# EAGLE design Pure_Seq_SMD_V2_2 (EAGLE 7.5.0)
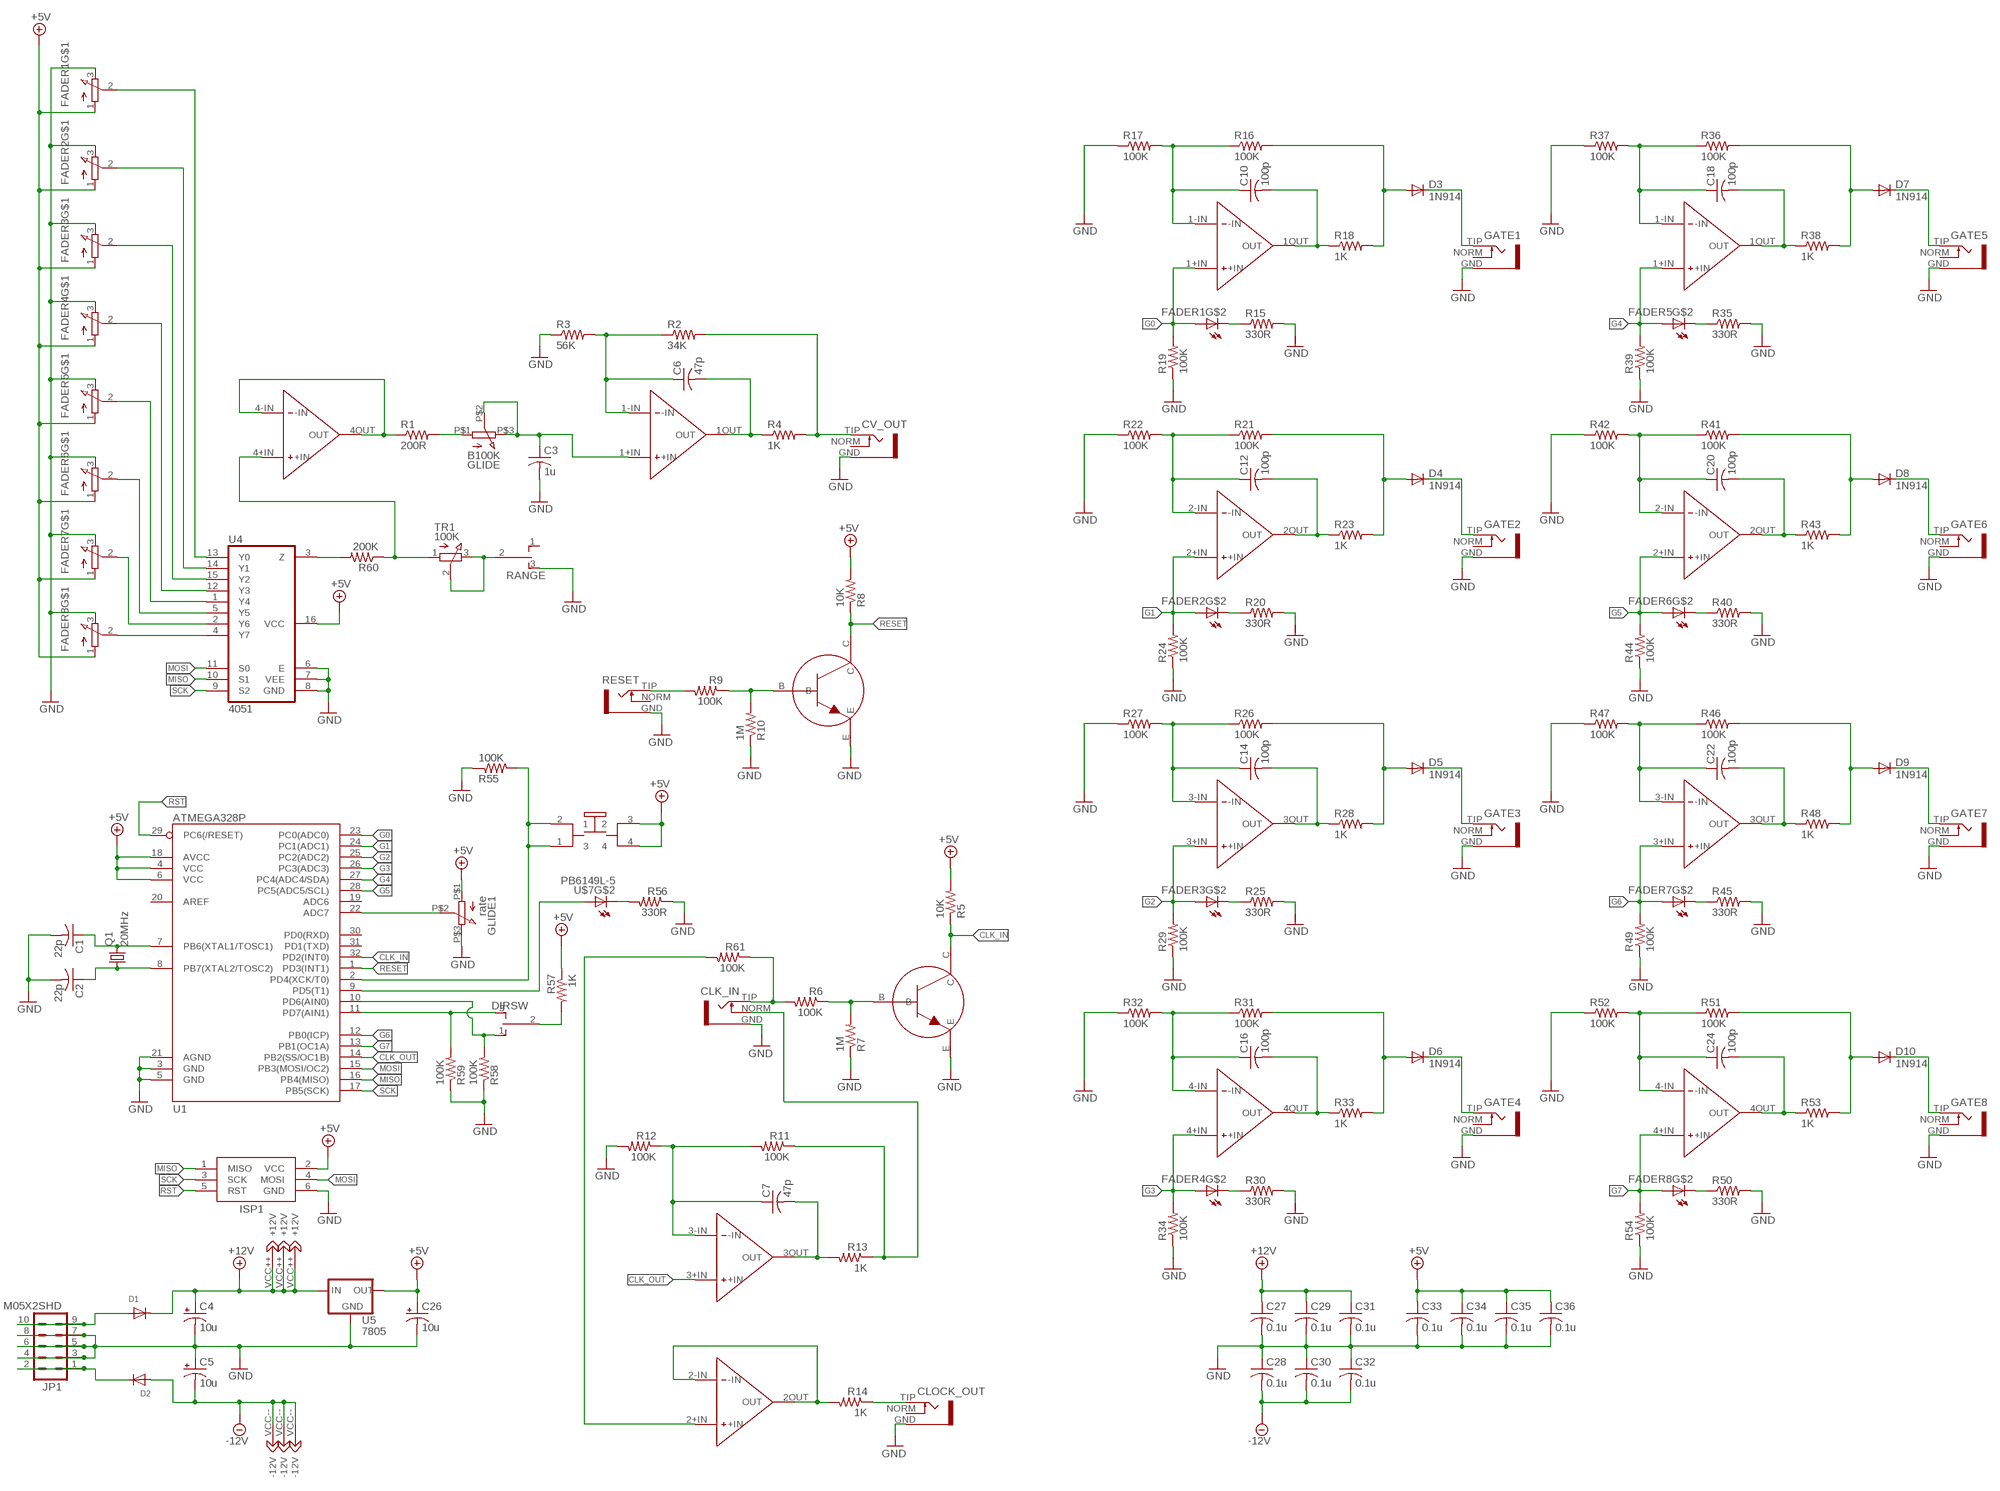
[diagram p0: schematic, sheet 1]

## Parts
C1  22p  C-USC0805K  [C0805K]
C2  22p  C-USC0805K  [C0805K]
C3  1u  C-USC0805K  [C0805K]
C4  10u  CPOL-US153CLV-0505  [153CLV-0505]
C5  10u  CPOL-US153CLV-0505  [153CLV-0505]
C6  47p  C-USC0805K  [C0805K]
C7  47p  C-USC0805K  [C0805K]
C10  100p  C-USC0805K  [C0805K]
C12  100p  C-USC0805K  [C0805K]
C14  100p  C-USC0805K  [C0805K]
C16  100p  C-USC0805K  [C0805K]
C18  100p  C-USC0805K  [C0805K]
C20  100p  C-USC0805K  [C0805K]
C22  100p  C-USC0805K  [C0805K]
C24  100p  C-USC0805K  [C0805K]
C26  10u  CPOL-US153CLV-0505  [153CLV-0505]
C27  0.1u  C-USC0805K  [C0805K]
C28  0.1u  C-USC0805K  [C0805K]
C29  0.1u  C-USC0805K  [C0805K]
C30  0.1u  C-USC0805K  [C0805K]
C31  0.1u  C-USC0805K  [C0805K]
C32  0.1u  C-USC0805K  [C0805K]
C33  0.1u  C-USC0805K  [C0805K]
C34  0.1u  C-USC0805K  [C0805K]
C35  0.1u  C-USC0805K  [C0805K]
C36  0.1u  C-USC0805K  [C0805K]
CLK_IN  S_JACK  [S_JACK]
CLOCK_OUT  S_JACK  [S_JACK]
CV_OUT  S_JACK  [S_JACK]
D1  DIODESMA  [SMADIODE]
D2  DIODESMA  [SMADIODE]
D3  1N914  DIODESOD  [SOD-323]
D4  1N914  DIODESOD  [SOD-323]
D5  1N914  DIODESOD  [SOD-323]
D6  1N914  DIODESOD  [SOD-323]
D7  1N914  DIODESOD  [SOD-323]
D8  1N914  DIODESOD  [SOD-323]
D9  1N914  DIODESOD  [SOD-323]
D10  1N914  DIODESOD  [SOD-323]
DIRSW  TOGGLE_ON_OFF_ON  [TOGGLE_ON_OFF_ON]
FADER1  LED_FADER  [LED_FADER]
FADER2  LED_FADER  [LED_FADER]
FADER3  LED_FADER  [LED_FADER]
FADER4  LED_FADER  [LED_FADER]
FADER5  LED_FADER  [LED_FADER]
FADER6  LED_FADER  [LED_FADER]
FADER7  LED_FADER  [LED_FADER]
FADER8  LED_FADER  [LED_FADER]
GATE1  S_JACK  [S_JACK]
GATE2  S_JACK  [S_JACK]
GATE3  S_JACK  [S_JACK]
GATE4  S_JACK  [S_JACK]
GATE5  S_JACK  [S_JACK]
GATE6  S_JACK  [S_JACK]
GATE7  S_JACK  [S_JACK]
GATE8  S_JACK  [S_JACK]
GLIDE  B100K  Q-POT  [Q-POT]
GLIDE1  rate  Q-POT  [Q-POT]
ISP1  AVRISP-6  [AVRISP]
JP1  M05X2SHD  [2X5-SHROUDED]
Q1  20MHz  CRYSTALHC49UP  [HC49UP]
R1  200R  R-US_R0805  [R0805]
R2  34K  R-US_R0805  [R0805]
R3  56K  R-US_R0805  [R0805]
R4  1K  R-US_R0805  [R0805]
R5  10K  R-US_R0805  [R0805]
R6  100K  R-US_R0805  [R0805]
R7  1M  R-US_R0805  [R0805]
R8  10K  R-US_R0805  [R0805]
R9  100K  R-US_R0805  [R0805]
R10  1M  R-US_R0805  [R0805]
R11  100K  R-US_R0805  [R0805]
R12  100K  R-US_R0805  [R0805]
R13  1K  R-US_R0805  [R0805]
R14  1K  R-US_R0805  [R0805]
R15  330R  R-US_R0805  [R0805]
R16  100K  R-US_R0805  [R0805]
R17  100K  R-US_R0805  [R0805]
R18  1K  R-US_R0805  [R0805]
R19  100K  R-US_R0805  [R0805]
R20  330R  R-US_R0805  [R0805]
R21  100K  R-US_R0805  [R0805]
R22  100K  R-US_R0805  [R0805]
R23  1K  R-US_R0805  [R0805]
R24  100K  R-US_R0805  [R0805]
R25  330R  R-US_R0805  [R0805]
R26  100K  R-US_R0805  [R0805]
R27  100K  R-US_R0805  [R0805]
R28  1K  R-US_R0805  [R0805]
R29  100K  R-US_R0805  [R0805]
R30  330R  R-US_R0805  [R0805]
R31  100K  R-US_R0805  [R0805]
R32  100K  R-US_R0805  [R0805]
R33  1K  R-US_R0805  [R0805]
R34  100K  R-US_R0805  [R0805]
R35  330R  R-US_R0805  [R0805]
R36  100K  R-US_R0805  [R0805]
R37  100K  R-US_R0805  [R0805]
R38  1K  R-US_R0805  [R0805]
R39  100K  R-US_R0805  [R0805]
R40  330R  R-US_R0805  [R0805]
R41  100K  R-US_R0805  [R0805]
R42  100K  R-US_R0805  [R0805]
R43  1K  R-US_R0805  [R0805]
R44  100K  R-US_R0805  [R0805]
R45  330R  R-US_R0805  [R0805]
R46  100K  R-US_R0805  [R0805]
R47  100K  R-US_R0805  [R0805]
R48  1K  R-US_R0805  [R0805]
R49  100K  R-US_R0805  [R0805]
R50  330R  R-US_R0805  [R0805]
R51  100K  R-US_R0805  [R0805]
R52  100K  R-US_R0805  [R0805]
R53  1K  R-US_R0805  [R0805]
R54  100K  R-US_R0805  [R0805]
R55  100K  R-US_R0805  [R0805]
R56  330R  R-US_R0805  [R0805]
R57  1K  R-US_R0805  [R0805]
R58  100K  R-US_R0805  [R0805]
R59  100K  R-US_R0805  [R0805]
R60  200K  R-US_R0805  [R0805]
R61  100K  R-US_R0805  [R0805]
RANGE  TOGGLE_ON_OFF_ON  [TOGGLE_ON_OFF_ON]
RESET  S_JACK  [S_JACK]
T1  2N3904  TRANSISTOR_MMBT3904  [TRANSISTOR_SINGLE_N-TYPE]
T2  2N3904  TRANSISTOR_MMBT3904  [TRANSISTOR_SINGLE_N-TYPE]
TR1  100K  TRIMMER_TH3  [TRIMMER_TH3]
U1  ATMEGA328P  ATMEGA328_SMT  [TQFP32-08]
U2  QUAD_OPAMP  [QUAD_OPAMP]
U3  QUAD_OPAMP  [QUAD_OPAMP]
U4  4051  MUX!  [N2222_ARRAY]
U5  7805  V-REG  [V-REG]
U6  QUAD_OPAMP  [QUAD_OPAMP]
U$7  PB6149L-5  [PB6149L]

## Nets
+5V: C26.+ C33.1 C34.1 C35.1 C36.1 FADER1.1 FADER2.1 FADER3.1 FADER4.1 FADER5.1 FADER6.1 FADER7.1 FADER8.1 GLIDE1.P$1 ISP1.2(VCC) R5.2 R8.2 R57.1 U1.4(VCC) U1.6(VCC) U1.18(AVCC) U4.16(VCC) U5.3(OUT) U$7.3 U$7.4
+12V: C4.+ C27.1 C29.1 C31.1 D1.C U2.VCC++(+12V) U3.VCC++(+12V) U5.1(IN) U6.VCC++(+12V)
-12V: C5.- C28.2 C30.2 C32.2 D2.A U2.VCC--(-12V) U3.VCC--(-12V) U6.VCC--(-12V)
CLK_IN: R5.1 T1.C U1.32(PD2(INT0))
CLK_OUT: U1.14(PB2(SS/OC1B)) U6.3+IN(+IN)
G0: FADER1.A R19.2 U1.23(PC0(ADC0)) U2.1+IN(+IN)
G1: FADER2.A R24.2 U1.24(PC1(ADC1)) U2.2+IN(+IN)
G2: FADER3.A R29.2 U1.25(PC2(ADC2)) U2.3+IN(+IN)
G3: FADER4.A R34.2 U1.26(PC3(ADC3)) U2.4+IN(+IN)
G4: FADER5.A R39.2 U1.27(PC4(ADC4/SDA)) U3.1+IN(+IN)
G5: FADER6.A R44.2 U1.28(PC5(ADC5/SCL)) U3.2+IN(+IN)
G6: FADER7.A R49.2 U1.12(PB0(ICP)) U3.3+IN(+IN)
G7: FADER8.A R54.2 U1.13(PB1(OC1A)) U3.4+IN(+IN)
GND: C1.2 C2.2 C3.2 C4.- C5.+ C26.- C27.2 C28.1 C29.2 C30.1 C31.2 C32.1 C33.2 C34.2 C35.2 C36.2 CLK_IN.GND CLOCK_OUT.GND CV_OUT.GND FADER1.3 FADER2.3 FADER3.3 FADER4.3 FADER5.3 FADER6.3 FADER7.3 FADER8.3 GATE1.GND GATE2.GND GATE3.GND GATE4.GND GATE5.GND GATE6.GND GATE7.GND GATE8.GND GLIDE1.P$3 ISP1.6(GND) JP1.3 JP1.4 JP1.5 JP1.6 JP1.7 JP1.8 R3.1 R7.1 R10.1 R12.2 R15.2 R17.1 R19.1 R20.2 R22.1 R24.1 R25.2 R27.1 R29.1 R30.2 R32.1 R34.1 R35.2 R37.1 R39.1 R40.2 R42.1 R44.1 R45.2 R47.1 R49.1 R50.2 R52.1 R54.1 R55.1 R56.1 R58.1 R59.1 RANGE.3(S) RESET.GND T1.E T2.E U1.3(GND) U1.5(GND) U1.21(AGND) U4.6(E) U4.7(VEE) U4.8(GND) U5.4(GND)
MISO: ISP1.1(MISO) U1.16(PB4(MISO)) U4.10(S1)
MOSI: ISP1.4(MOSI) U1.15(PB3(MOSI/OC2)) U4.11(S0)
N$1: C1.1 Q1.2 U1.7(PB6(XTAL1/TOSC1))
N$2: C2.1 Q1.1 U1.8(PB7(XTAL2/TOSC2))
N$3: R60.1 TR1.1 U6.4+IN(+IN)
N$4: R1.1 U6.4-IN(-IN) U6.4OUT(OUT)
N$5: GLIDE.P$1 R1.2
N$6: FADER8.2 U4.4(Y7)
N$7: FADER7.2 U4.2(Y6)
N$8: FADER6.2 U4.5(Y5)
N$9: D1.A JP1.9 JP1.10
N$10: D2.C JP1.1 JP1.2
N$11: FADER5.2 U4.1(Y4)
N$12: FADER4.2 U4.12(Y3)
N$13: FADER3.2 U4.15(Y2)
N$14: FADER2.2 U4.14(Y1)
N$15: FADER1.2 U4.13(Y0)
N$16: C3.1 GLIDE.P$2 GLIDE.P$3 U6.1+IN(+IN)
N$17: R6.1 R7.2 T1.B
N$18: R61.2 U6.2+IN(+IN)
N$19: C6.1 R2.1 R3.2 U6.1-IN(-IN)
N$20: C6.2 R4.1 U6.1OUT(OUT)
N$21: CV_OUT.TIP R2.2 R4.2
N$22: R9.1 R10.2 T2.B
N$23: R9.2 RESET.TIP
N$24: C7.1 R11.2 R12.1 U6.3-IN(-IN)
N$25: C7.2 R13.2 U6.3OUT(OUT)
N$26: CLK_IN.TIP R6.2 R61.1
N$27: R14.2 U6.2-IN(-IN) U6.2OUT(OUT)
N$28: CLOCK_OUT.TIP R14.1
N$29: CLK_IN.NORM R11.1 R13.1
N$30: GLIDE1.P$2 U1.22(ADC7)
N$31: FADER1.K(C) R15.1
N$32: C10.1 R16.1 R17.2 U2.1-IN(-IN)
N$33: C10.2 R18.1 U2.1OUT(OUT)
N$34: D3.2(A) R16.2 R18.2
N$35: FADER3.K(C) R25.1
N$36: FADER2.K(C) R20.1
N$37: C12.1 R21.1 R22.2 U2.2-IN(-IN)
N$38: C12.2 R23.1 U2.2OUT(OUT)
N$39: D4.2(A) R21.2 R23.2
N$40: C14.1 R26.1 R27.2 U2.3-IN(-IN)
N$41: C14.2 R28.1 U2.3OUT(OUT)
N$42: D5.2(A) R26.2 R28.2
N$43: FADER4.K(C) R30.1
N$44: C16.1 R31.1 R32.2 U2.4-IN(-IN)
N$45: C16.2 R33.1 U2.4OUT(OUT)
N$46: D6.2(A) R31.2 R33.2
N$47: FADER5.K(C) R35.1
N$48: C18.1 R36.1 R37.2 U3.1-IN(-IN)
N$49: C18.2 R38.1 U3.1OUT(OUT)
N$50: D7.2(A) R36.2 R38.2
N$51: FADER6.K(C) R40.1
N$52: C20.1 R41.1 R42.2 U3.2-IN(-IN)
N$53: C20.2 R43.1 U3.2OUT(OUT)
N$54: D8.2(A) R41.2 R43.2
N$55: FADER7.K(C) R45.1
N$56: C22.1 R46.1 R47.2 U3.3-IN(-IN)
N$57: C22.2 R48.1 U3.3OUT(OUT)
N$58: D9.2(A) R46.2 R48.2
N$59: FADER8.K(C) R50.1
N$60: C24.1 R51.1 R52.2 U3.4-IN(-IN)
N$61: C24.2 R53.1 U3.4OUT(OUT)
N$62: D10.2(A) R51.2 R53.2
N$63: R55.2 U1.2(PD4(XCK/T0)) U$7.1 U$7.2
N$64: U1.9(PD5(T1)) U$7.A
N$65: R56.2 U$7.K(C)
N$66: DIRSW.2(P) R57.2
N$67: DIRSW.1(O) R58.2 U1.10(PD6(AIN0))
N$68: DIRSW.3(S) R59.2 U1.11(PD7(AIN1))
N$69: R60.2 U4.3(Z)
N$70: RANGE.2(P) TR1.2 TR1.3
N$71: D6.1(C) GATE4.TIP
N$72: D5.1(C) GATE3.TIP
N$73: D4.1(C) GATE2.TIP
N$74: D3.1(C) GATE1.TIP
N$75: D10.1(C) GATE8.TIP
N$76: D9.1(C) GATE7.TIP
N$77: D8.1(C) GATE6.TIP
N$78: D7.1(C) GATE5.TIP
RESET: R8.1 T2.C U1.1(PD3(INT1))
RST: ISP1.5(RST) U1.29(PC6(/RESET))
SCK: ISP1.3(SCK) U1.17(PB5(SCK)) U4.9(S2)
Unconnected: CLOCK_OUT.NORM CV_OUT.NORM GATE1.NORM GATE2.NORM GATE3.NORM GATE4.NORM GATE5.NORM GATE6.NORM GATE7.NORM GATE8.NORM RANGE.1(O) RESET.NORM U1.19(ADC6) U1.20(AREF) U1.30(PD0(RXD)) U1.31(PD1(TXD))

## Library data of the parts
C1-C3 C6 C7 C10 C12 C14 C16 C18 C20 C22 C24 C27-C36 = rcl:C-US: CAPACITOR, American symbol
C4 C5 C26 = rcl:CPOL-US: POLARIZED CAPACITOR, American symbol
CLK_IN CLOCK_OUT CV_OUT GATE1-GATE8 RESET = INSTRUO:S_JACK
D1 D2 = adafruit:DIODE: Diode
D3-D10 = SparkFun-DiscreteSemi:DIODE: Diode
DIRSW RANGE = INSTRUO:TOGGLE_ON_OFF_ON
FADER1-FADER8 = INSTRUO:LED_FADER
GLIDE GLIDE1 = INSTRUO:Q-POT
ISP1 = adafruit:AVRISP: AVR ISP HEADER Standard 6 pin header for AVR programming
JP1 = SparkFun-Connectors:M05X2: Header 5x2 Standard 10-pin dual row 0.1" header. Commonly used with AVR-ISP. Use with Spark Fun Electronics SKU: PRT-00778
Q1 = adafruit:CRYSTAL: CRYSTAL; OC_FARNELL: unknown; OC_NEWARK: unknown
R1-R61 = rcl:R-US_: RESISTOR, American symbol
T1 T2 = INSTRUO:TRANSISTOR_MMBT3904
TR1 = INSTRUO:TRIMMER_TH3
U1 = SparkFun-DigitalIC:ATMEGA328_SMT: 32-Pin Atmega328 part Commonly used on Arduino compatible boards Available in QFP and QFN packages TQFP is IC-09069 QFN is non-stock; PROD_ID: IC-09069
U2 U3 U6 = INSTRUO:QUAD_OPAMP
U4 = INSTRUO:MUX!
U5 = INSTRUO:V-REG
U$7 = INSTRUO:PB6149L-5

## Board
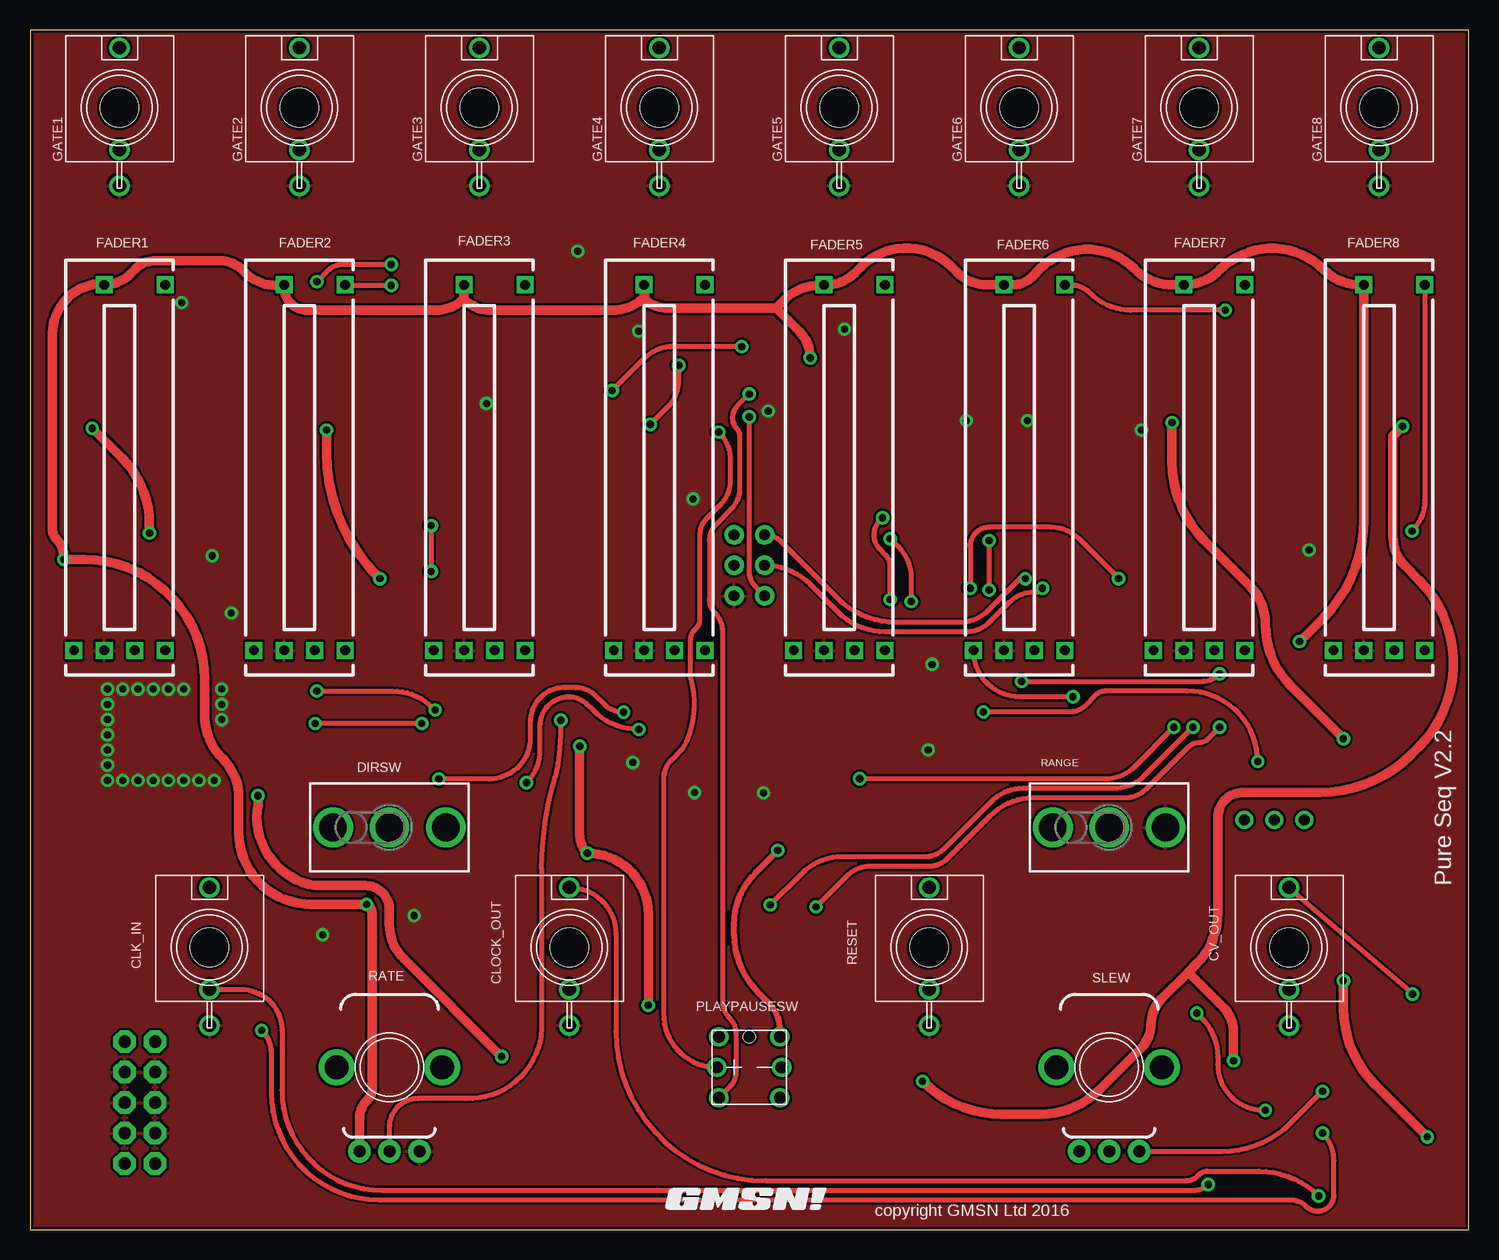
[diagram p1: board, top side]
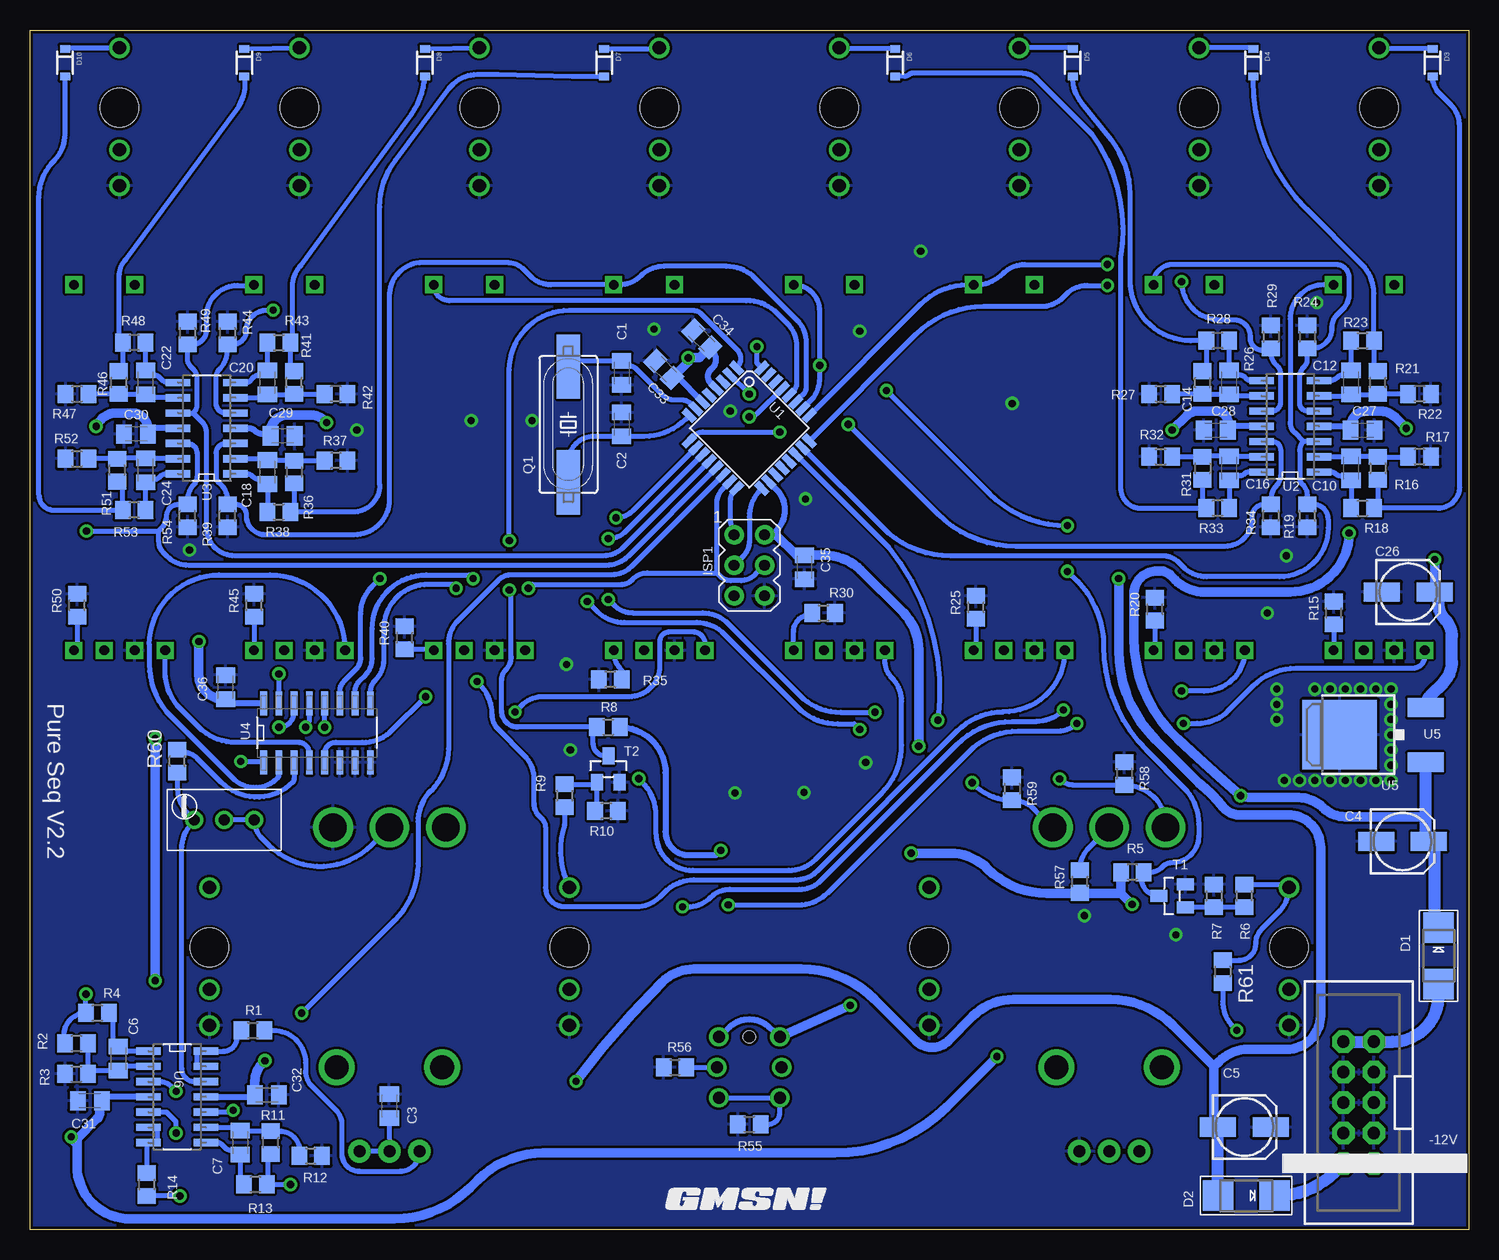
[diagram p2: board, bottom side, seen from below]

Size 119.92 x 100 mm. Coordinates in mm from the lower left corner, seen from the top.
Outline: 0,0 119.92,0 119.92,100 0,100 0,0
Copper layers (1*16): Top 0.035mm / dielectric 1.5mm / Bottom 0.035mm
Design rules "SparkFun": minimum track width 8mil, minimum drill 20mil, track to track 8mil, track to pad 8mil, pad to pad 8mil, via to via 8mil, smd to smd 8mil, copper to edge 10mil, drill to drill 8mil, minimum pad ring 12mil, minimum via ring 10mil, stop-mask expansion 4mil, vias tented up to drill 25mil, thermal gap 10mil
Holes 3.2 mm at 7.46,93.52 22.46,93.52 37.46,93.52 52.46,93.52 67.46,93.52 82.46,93.52 97.46,93.52 112.46,93.52 104.96,23.52 74.96,23.52 44.96,23.52 14.96,23.52

### Footprints (pad centres in the part's own frame; a part is rotated, then mirrored left to right if it is on the bottom)
C0805K = smd 1.3 x 1.6: 1 -1,0; 2 1,0
153CLV-0505 = smd 3 x 1.6: + 2.2,0; - -2.2,0
S_JACK = drill 1.1: GND 0,-6.5; NORM 0,-3.5; TIP 0,5
SMADIODE = smd 2.54 x 2.54: A 2.349,0; C -2.349,0
SOD-323 = smd 0.63 x 0.83: 1 -1.15,0; 2 1.15,0
TOGGLE_ON_OFF_ON = drill 2.3: 1 -4.7,0; 2 0,0; 3 4.7,0
LED_FADER = drill 0.8 square: 1 -1.27,15.24; 2 -3.81,-15.24; 3 -1.27,-15.24; A 3.81,15.24; K 3.81,-15.24; P$3 1.27,-15.24
Q-POT = drill 1 pad 1.88: P$1 -2.5,-7; P$2 0,-7; P$3 2.5,-7 | drill 2 pad 2.68: P$4 -4.4,0; P$5 4.4,0
AVRISP = drill 0.9 pad 1.626: 1 -1.27,2.54; 2 1.27,2.54; 3 -1.27,0; 4 1.27,0; 5 -1.27,-2.54; 6 1.27,-2.54
2X5-SHROUDED = drill 1.016 pad 1.88 octagon: 1 -1.27,5.08; 2 1.27,5.08; 3 -1.27,2.54; 4 1.27,2.54; 5 -1.27,0; 6 1.27,0; 7 -1.27,-2.54; 8 1.27,-2.54; 9 -1.27,-5.08; 10 1.27,-5.08
HC49UP = smd 5.334 x 1.93: 1 -4.826,0; 2 4.826,0
R0805 = smd 1.3 x 1.5: 1 -0.95,0; 2 0.95,0
TRANSISTOR_SINGLE_N-TYPE = smd 1 x 1.4: B -0.95,-1.1; C 0,1.1; E 0.95,-1.1
TRIMMER_TH3 = drill 0.9: 1 2.5,0; 2 0,0; 3 -2.5,0
TQFP32-08 = smd 1.27 x 0.559: 1 -4.293,2.8; 2 -4.293,2; 3 -4.293,1.2; 4 -4.293,0.4; 5 -4.293,-0.4; 6 -4.293,-1.2; 7 -4.293,-2; 8 -4.293,-2.8; 17 4.293,-2.8; 18 4.293,-2; 19 4.293,-1.2; 20 4.293,-0.4; 21 4.293,0.4; 22 4.293,1.2; 23 4.293,2; 24 4.293,2.8 | smd 0.559 x 1.27: 9 -2.8,-4.293; 10 -2,-4.293; 11 -1.2,-4.293; 12 -0.4,-4.293; 13 0.4,-4.293; 14 1.2,-4.293; 15 2,-4.293; 16 2.8,-4.293; 25 2.8,4.293; 26 2,4.293; 27 1.2,4.293; 28 0.4,4.293; 29 -0.4,4.293; 30 -1.2,4.293; 31 -2,4.293; 32 -2.8,4.293
QUAD_OPAMP = smd 2.057 x 0.61: 1+IN -2.419,1.27; 1-IN -2.419,2.54; 1OUT -2.419,3.81; 2+IN -2.419,-1.27; 2-IN -2.419,-2.54; 2OUT -2.419,-3.81; 3+IN 2.381,-1.27; 3-IN 2.381,-2.54; 3OUT 2.381,-3.81; 4+IN 2.381,1.27; 4-IN 2.381,2.54; 4OUT 2.381,3.81; VCC++ -2.419,0; VCC-- 2.381,0
N2222_ARRAY = smd 1.981 x 0.559: 1 -2.464,4.445; 2 -2.464,3.175; 3 -2.464,1.905; 4 -2.464,0.635; 5 -2.464,-0.635; 6 -2.464,-1.905; 7 -2.464,-3.175; 8 -2.464,-4.445; 9 2.464,-4.445; 10 2.464,-3.175; 11 2.464,-1.905; 12 2.464,-0.635; 13 2.464,0.635; 14 2.464,1.905; 15 2.464,3.175; 16 2.464,4.445
V-REG = smd 1.6 x 3: 1 -2.28,-4.8; 3 2.28,-4.8 | smd 5.8 x 6.2: 4 0,2.38
PB6149L = drill 1: 1 2.54,-2.54; 2 2.54,2.54; 3 -2.54,-2.54; 4 -2.54,2.54; A 0,-2.7; K 0,2.7 | hole 1: -2.54,0

### Placement (x,y rotation side)
C1  70.6,71.4 270 bottom
C2  70.6,67.12 90 bottom
C3  89.96,10.29 90 bottom
C4  5.51,32.35 0 bottom
C5  18.68,8.54 0 bottom
C6  112.56,14.23 90 bottom
C7  102.39,7.25 270 bottom
C10  9.79,63.47 270 bottom
C12  9.79,70.61 90 bottom
C14  19.95,70.61 90 bottom
C16  19.95,63.47 270 bottom
C18  100.12,63.15 270 bottom
C20  100.12,70.61 90 bottom
C22  110.28,70.61 90 bottom
C24  110.28,63.31 270 bottom
C26  5.03,53.15 0 bottom
C27  8.84,66.64 0 bottom
C28  21.07,66.64 0 bottom
C29  98.85,66.16 0 bottom
C30  111.08,66.32 0 bottom
C31  114.94,10.74 180 bottom
C32  100.17,11.22 180 bottom
C33  67.1,71.72 135 bottom
C34  63.93,74.26 135 bottom
C35  55.36,55.21 270 bottom
C36  103.62,45.21 90 bottom
CLK_IN  14.96,23.52 0 top
CLOCK_OUT  44.96,23.52 0 top
CV_OUT  104.96,23.52 0 top
D1  2.49,22.83 270 bottom
D2  18.53,2.82 180 bottom
D3  3,97.27 270 bottom
D4  17.95,97.27 270 bottom
D5  33,97.27 270 bottom
D6  47.79,97.27 270 bottom
D7  72.05,97.27 270 bottom
D8  87,97.27 270 bottom
D9  102.05,97.27 270 bottom
D10  117,97.27 270 bottom
DIRSW  29.96,33.52 0 top
FADER1  7.46,63.52 0 top
FADER2  22.46,63.52 0 top
FADER3  37.46,63.52 0 top
FADER4  52.46,63.52 0 top
FADER5  67.46,63.52 0 top
FADER6  82.46,63.52 0 top
FADER7  97.46,63.52 0 top
FADER8  112.46,63.52 0 top
GATE1  7.46,93.52 0 top
GATE2  22.46,93.52 0 top
GATE3  37.46,93.52 0 top
GATE4  52.46,93.52 0 top
GATE5  67.46,93.52 0 top
GATE6  82.46,93.52 0 top
GATE7  97.46,93.52 0 top
GATE8  112.46,93.52 0 top
GLIDE  89.96,13.52 0 top
GLIDE1  29.96,13.52 0 top
ISP1  59.96,55.37 0 bottom
JP1  9.16,10.58 180 bottom
Q1  75.04,67.12 90 bottom
R1  101.34,16.6 0 bottom
R2  116.05,15.5 180 bottom
R3  116.05,12.96 0 bottom
R4  114.3,18.04 180 bottom
R5  28.02,29.78 180 bottom
R6  18.68,27.81 90 bottom
R7  21.23,27.81 270 bottom
R8  71.71,41.88 0 bottom
R9  75.36,36.16 270 bottom
R10  71.87,34.89 180 bottom
R11  99.86,7.25 90 bottom
R12  96.52,6.14 0 bottom
R13  101.12,3.76 180 bottom
R14  110.17,3.76 90 bottom
R15  11.22,51.4 90 bottom
R16  7.57,63.47 270 bottom
R17  4.08,64.42 180 bottom
R18  8.84,60.13 0 bottom
R19  13.45,59.5 90 bottom
R20  26.15,51.72 90 bottom
R21  7.57,70.61 90 bottom
R22  4.08,69.66 180 bottom
R23  8.84,74.1 0 bottom
R24  13.45,74.42 270 bottom
R25  41.07,51.88 90 bottom
R26  22.18,70.61 90 bottom
R27  25.67,69.66 0 bottom
R28  20.91,74.1 180 bottom
R29  16.46,74.42 270 bottom
R30  53.77,51.4 0 bottom
R31  22.18,63.47 270 bottom
R32  25.67,64.42 0 bottom
R33  20.91,60.13 180 bottom
R34  16.46,59.5 90 bottom
R35  71.55,45.84 180 bottom
R36  97.9,63.15 270 bottom
R37  94.41,64.1 180 bottom
R38  99.17,59.81 0 bottom
R39  103.46,59.5 90 bottom
R40  88.69,49.34 90 bottom
R41  97.9,70.61 90 bottom
R42  94.41,69.66 180 bottom
R43  99.17,73.94 0 bottom
R44  103.46,74.74 270 bottom
R45  101.23,52.04 90 bottom
R46  112.51,70.61 90 bottom
R47  116,69.66 0 bottom
R48  111.24,73.94 180 bottom
R49  106.79,74.74 270 bottom
R50  116,52.04 90 bottom
R51  112.67,63.31 270 bottom
R52  116,64.26 0 bottom
R53  111.24,59.97 180 bottom
R54  106.79,59.5 90 bottom
R55  59.96,8.76 0 bottom
R56  66.15,13.52 0 bottom
R57  32.4,29.02 90 bottom
R58  28.69,38.01 270 bottom
R59  38.05,36.74 270 bottom
R60  107.64,39.04 90 bottom
R61  20.5,21.5 270 bottom
RANGE  89.96,33.52 0 top
RESET  74.96,23.52 0 top
T1  24.72,27.81 90 bottom
T2  71.71,38.38 0 bottom
TR1  103.73,34.14 180 bottom
U1  59.96,66.8 315 bottom
U2  14.88,66.96 180 bottom
U3  105.2,66.8 180 bottom
U4  96,41.4 90 bottom
U5  8.37,41.24 90 bottom
U6  107.63,11.06 0 bottom
U$1  [GMSN!_LOGO]  59.96,2.48 0 top
U$2  [GMSN!_LOGO]  59.96,2.48 0 bottom
U$7  59.96,13.52 270 top

### Tracks (layer width: path | path; a pad name or v marks a point on that pad's centre or on a via)
+5V  (via drill 0.6)
  Top 0.5: U$7.4 62.5,16.64 arc45 61.56,18.91 60.64,19.82 arc-45 58.69,24.54 58.69,25.38 arc-45 60.51,29.77 v62.34,31.61
  Top 0.8: GLIDE1.P$1 27.46,9.26 arc-45 28.06,10.71 arc45 28.53,11.83 28.53,26.12 arc45 28.05,27.27 v28.05,27.11 23.39,27.11 arc-90 17.41,33.09 17.41,35.97 arc45 16.04,39.28 arc-45 14.56,42.87 14.56,45.83 arc90 4.54,55.85 v2.81,55.85 2.81,56.09 arc45 2.2,57.57 arc-45 1.86,58.39 1.86,74.64 arc-90 6.08,78.86 FADER1.1 arc45 8.37,79.66 8.78,80.07 arc-45 10.46,80.77 15.84,80.77 arc-45 17.71,80 17.93,79.78 arc45 20.52,78.71 21.14,78.71 FADER2.1 21.19,78.51 arc90 23.06,76.64 33.85,76.64 arc45 36.15,77.59 36.15,78.72 FADER3.1 36.19,77.55 arc45 38.39,76.64 48.55,76.64 arc45 51.23,77.75 51.23,78.72 FADER4.1 51.19,77.63 51.23,77.59 arc45 53.14,76.8 62.18,76.8 | 62.55,16.06 U$7.4 | 62.18,76.8 62.9,77.52 arc-45 65.77,78.71 66.14,78.71 FADER5.1 66.4,78.76 arc45 68.78,79.75 69.3,80.26 arc-90 76.82,80.26 77.32,79.76 arc45 79.74,78.76 FADER6.1 81.99,78.76 arc45 83.5,79.39 84.2,80.08 arc-90 92.08,80.08 arc45 95.27,78.76 FADER7.1 arc45 99.2,80.01 arc-90 107.87,80.01 arc45 110.88,78.76 FADER8.1 111.19,59.2 arc-45 107.77,50.95 v105.84,49.02 | 62.18,76.8 64.14,74.84 arc-45 v65.04,72.67 | v51.55,18.69 51.55,26.29 arc90 v46.47,31.37 arc-45 45.83,32.9 v45.83,40.29
  Bottom 0.4: R57.1 32.34,28.04
  Bottom 0.5: U4.16 103.27,43.86 C36.1 | U1.4 63.19,70.6 arc90 63.19,71.66 63.02,71.84 arc-90 63.02,73.19 63.22,73.39 C34.1 | U1.6 66,71.14 66,71.41 | U1.18 57.74,61.75 arc90 57.74,58.23 57.74,57.91 | R8.2 arc90 66.94,38.06 66.94,33.15 arc-90 65.01,31.21 62.73,31.21 v62.34,31.61 | U$7.3 58.33,16.88 arc-84 61.59,16.88 U$7.4
  Bottom 0.8: v2.81,55.85 2.83,55.82 C26.+ | v105.84,49.02 105.84,46.19 arc-90 103.9,44.26 103.66,44.26 C36.1 | C34.1 64.1,72.67 v65.04,72.67 65.04,72.37 66,71.41 C33.1 | ISP1.2 57.74,57.91 56.04,56.21 C35.1 53.66,56.21 arc45 50.68,54.98 47.13,51.43 arc45 45.83,48.3 v45.83,40.29 | v51.55,18.69 U$7.3 | R5.2 28.97,28.04 | 28.97,28.04 v28.05,27.11 | v46.47,31.37 43.22,31.37 arc45 40.09,30.08 arc-45 35.17,28.04 32.34,28.04 28.98,28.04 28.97,28.04
  Bottom 1.016: U5.3 arc45 3.13,44.57 2.08,45.62 arc-45 1.38,47.32 1.38,49.46 arc-45 1.97,50.88 arc45 2.49,52.14 2.49,52.81 C26.+
+12V  (via drill 0.6)
  Top 0.8: v9.95,58.07 9.95,58.83 arc45 7.69,64.3 v5.19,66.8 | v95.2,67.28 95.2,63.94 arc45 97.9,57.44 101.68,53.66 arc-45 102.98,50.51 102.98,50.44 arc45 105.11,45.3 v109.49,40.92 | v39.32,14.41 31.13,22.6 arc-45 29.96,25.44 29.96,26.68 arc90 27.97,28.67 23.74,28.67 arc-90 19,35.41 v19,36.16 | v109.49,20.74 109.49,18.49 arc45 112.17,12.03 v116.47,7.72
  Bottom 0.5: U2.VCC++ 10.16,66.96 C27.1 | U6.VCC++ 113.62,11.06 | U3.VCC++ 101.63,66.8 arc45 101.23,66.63 arc-45 100.48,66.32 100.01,66.32 C29.1
  Bottom 0.8: 3.57,32.61 3.57,34.38 3.6,34.42 10.31,34.42 arc45 12.14,35.17 arc-45 14.14,36 18.37,36 v19,36.16 arc2 24.24,40.9 arc47 27.89,49.3 27.89,52.98 arc90 25.98,54.89 25.67,54.89 arc45 24.86,54.56 24.45,54.15 arc-45 22.02,53.15 14.88,53.15 arc-90 v9.95,58.07 | v5.19,66.8 6.1,67.71 arc-45 7.36,68.23 8.55,68.23 arc-90 9.79,66.99 9.79,66.69 C27.1 | C31.1 113.94,10.68 | v39.32,14.41 43.49,10.25 arc45 52.83,6.38 77.15,6.38 arc-45 82.61,4.12 83.23,3.5 arc45 89.52,0.89 111.58,0.89 arc90 116,5.3 116,7.08 | 113.62,11.06 C31.1 | C29.1 99.85,66.52 arc90 98.46,67.91 96.57,67.91 arc45 95.32,67.39 v95.2,67.28 | v109.49,40.92 v109.49,20.74 | 116,7.08 116,7.56 114.34,9.21 arc-45 114.09,9.82 114.09,10.58 C31.1 | v116.47,7.72 116.47,7.56 116,7.08
  Bottom 1.016: D1.C 2.81,25.49 2.81,32.03 3.13,32.35 C4.+ 3.57,32.61 U5.1
-12V  (via drill 0.6)
  Top 0.8: v114.41,66.96 113.62,66.16 113.62,57.71 arc45 114.6,55.34 115.78,54.16 arc-90 115.78,40.22 115.17,39.61 arc-45 107.53,36.45 101.15,36.45 arc90 99.01,34.31 99.01,26.35 arc-45 97.29,22.18 96.55,21.45 | v29.16,54.26 29.04,54.38 arc-45 24.72,64.82 v24.72,66.64 | v74.41,12.35 arc45 80.99,9.62 84.3,9.62 arc45 89.09,11.61 92.63,15.15 arc45 93.46,17.14 arc-45 94.31,19.21 96.55,21.45 | v100.33,14.07 100.33,16.51 arc45 99.51,18.49 96.55,21.45
  Bottom 0.5: U3.VCC-- 109.6,66.8 C30.2 | U2.VCC-- 19.75,66.96 C28.2 | U6.VCC-- 101.33,11.06 C32.2
  Bottom 0.8: 21.23,13.59 24.66,17.03 arc-45 29.85,19.18 37.93,19.18 arc-45 41.34,17.76 43.37,15.73 arc90 46.07,15.73 49.51,19.18 arc-45 55.64,21.71 64.58,21.71 arc-45 67.22,20.62 arc-8 v74.41,12.35 | v100.33,14.07 100.52,13.88 arc-45 101.17,12.31 C32.2 | v114.41,66.96 114.41,67.12 114,67.53 arc45 112.69,68.07 111.36,68.07 arc90 110.12,66.83 110.12,66.37 C30.2 | v29.16,54.26 29.16,48.28 arc-45 26.07,40.83 22.5,37.25 arc13 20.43,35.18 arc-51 19.17,34.57 15.03,34.57 arc90 12.34,31.87 12.34,17.83 arc90 15.14,15.02 18.41,15.02 arc-45 20.78,14.04 21.23,13.59 | v24.72,66.64 23.49,67.87 arc45 22.62,68.23 21,68.23 arc90 20.07,67.3 C28.2 | 21.23,13.59 21.23,8.88 C5.-
  Bottom 1.016: D2.A 20.89,2.83 C5.-
CLK_IN  (via drill 0.6)
  Top 0.4: v59.33,73.6 53.56,73.6 arc45 51.2,72.62 v48.53,69.95 | v33.45,58.68 v33.45,54.87
  Bottom 0.4: U1.32 59.33,72.24 v59.33,73.6 | v48.53,69.95 39.95,61.37 arc-45 v33.45,58.68 | v33.45,54.87 32.63,54.04 arc45 30.43,48.75 30.43,48.62 arc-45 26.83,39.93 23.75,36.85 arc45 22.5,33.81 22.5,32.81 arc90 24.73,30.58 arc-45 25.52,30.25 25.62,30.15 arc45 26.5,29.78 R5.1 27.26,29.6 27.26,29.25 arc-90 T1.C
CLK_OUT  (via drill 0.6)
  Top 0.4: v97.27,18.04 97.66,17.64 arc-45 99.01,14.38 99.01,13.78 arc90 102.86,9.94 v102.98,9.94
  Bottom 0.4: U1.14 69.82,55.24 arc45 71.42,54.58 79.79,54.58 arc-45 80.9,54.12 84.25,50.76 arc-45 85.04,48.85 85.04,40.1 arc45 86.5,36.58 86.51,36.57 arc-45 87.58,33.98 87.58,30.48 arc45 89.54,25.77 v97.27,18.04 | v102.98,9.94 103.13,9.79 U6.3+IN
G0
  Bottom 0.4: U2.1+IN 13.76,65.69 | 13.76,65.69 arc-45 14.08,64.92 14.08,62.71 arc-45 13.83,62.1 13.82,62.09 arc45 13.45,61.19 R19.2 12.94,60.45 arc90 11.7,59.21 11.7,58.48 arc90 15.77,54.42 21.84,54.42 arc45 23.77,55.22 24.16,55.6 arc-45 25.51,56.16 43.19,56.16 arc45 48.84,58.5 U1.23 | FADER1.A 12.03,78.76 arc-90 14.88,75.91 14.88,67.28 arc-45 14.54,66.46 13.76,65.69
G1  (via drill 0.6)
  Top 0.4: v30.11,78.71 26.32,78.71 FADER2.A
  Bottom 0.4: U2.2+IN 13.43,68.23 arc90 14.08,68.88 14.08,71.03 arc45 13.71,71.94 13.65,71.99 arc-45 13.45,72.49 R24.2 13.02,73.47 arc-90 11.38,75.1 11.38,75.24 arc45 10.95,76.28 10.42,76.81 arc-45 9.95,77.94 9.95,79.33 arc-90 11.08,80.45 24.65,80.45 arc-90 26.3,78.8 FADER2.A | U1.24 46.06,74.63 arc45 40.44,76.96 35.59,76.96 arc-45 33.83,77.69 33.54,77.98 arc45 31.79,78.71 v30.11,78.71
G2  (via drill 0.6)
  Top 0.4: v30.11,80.45 26.09,80.45 arc45 24.83,79.93 v23.92,79.02
  Bottom 0.4: U2.3+IN 16.38,68.23 arc-90 15.67,68.94 15.67,71.37 arc-45 15.92,71.97 16.09,72.14 arc45 16.46,73.04 R29.2 16.62,73.31 17.19,73.31 arc90 18.21,74.33 18.21,74.48 arc-90 19.57,75.85 20.75,75.85 arc90 v23.92,79.02 | U1.25 45.63,77.17 arc45 41.79,78.76 FADER3.A 41.08,78.76 arc-45 38.8,79.7 arc45 36.99,80.45 v30.11,80.45
G3  (via drill 0.6)
  Top 0.4: v51.7,67.12 53.15,68.56 arc45 54.09,70.83 v54.09,72.04
  Bottom 0.4: U2.4+IN 16.34,65.69 arc90 15.67,65.02 15.67,62.83 arc45 16,62.02 16.03,61.99 arc-45 16.46,60.95 R34.2 17.04,60.45 arc-90 18.05,59.43 18.05,59.2 arc90 20.3,56.96 37.74,56.96 arc45 44.23,59.64 v51.7,67.12 | U1.26 54.88,69.05 arc-45 54.09,70.97 v54.09,72.04 54.09,76.58 arc-90 FADER4.A
G4
  Bottom 0.4: U3.1+IN 103.62,65.53 arc-90 104.41,64.74 104.41,62.72 arc-45 104.26,62.37 104,62.1 arc45 103.46,60.79 R39.2 102.77,60.45 arc90 101.87,59.55 101.87,59.5 arc-90 100.28,57.91 92.92,57.91 arc-90 89.96,60.86 89.96,77.83 arc90 87.19,80.61 80.19,80.61 arc45 78.72,80 78.16,79.44 arc-45 76.51,78.76 FADER5.A 70.79,78.76 arc-45 69.02,79.49 arc45 67.08,80.29 61.87,80.29 arc45 59.42,79.28 56.01,75.87 arc45 55.2,73.91 55.2,70.26 arc45 55.48,69.58 U1.27
G5  (via drill 0.6)
  Top 0.4: v99.65,76.64 91.74,76.64 arc-45 88.44,78.01 arc45 86.63,78.76 FADER6.A
  Bottom 0.4: U3.2+IN 103.62,68.07 arc90 104.41,68.86 104.41,71.08 arc45 104.18,71.64 arc-45 103.46,73.38 R44.2 103.04,73.79 arc-90 101.87,74.95 arc90 100.18,76.64 v99.65,76.64 | U1.28 56.27,69.92 arc-45 55.99,70.6 55.99,73.64 arc-45 56.77,75.51 57.63,76.37 arc-45 60.19,77.44 84.95,77.44 arc90 FADER6.A
G6
  Bottom 0.4: U3.3+IN 106.31,68.07 | 106.31,68.07 106.23,68.16 arc-45 106,68.72 106,70.96 arc-45 106.31,71.72 106.51,71.92 arc45 106.79,72.59 R49.2 106.41,73.79 arc-90 105.2,74.99 105.2,76.12 arc90 102.62,78.71 101.32,78.71 FADER7.A | U1.12 70.47,56.86 arc45 72.15,56.16 102.84,56.16 arc90 105.2,58.52 105.2,66.4 arc-45 105.6,67.36 106.31,68.07
G7  (via drill 0.6)
  Top 0.4: FADER8.A 116.27,60.8 arc-45 v115.2,58.23
  Bottom 0.4: U3.4+IN 106.79,65.53 arc90 106,64.74 106,62.75 arc45 106.28,62.07 arc-45 106.79,60.84 R54.2 107.56,60.45 arc-90 108.54,59.47 arc45 108.97,58.43 109.17,58.23 | v115.2,58.23 109.17,58.23 | U1.13 70.08,56.11 arc45 71.88,55.37 106.68,55.37 arc45 108.49,56.12 108.8,56.42 arc45 109.17,57.33 109.17,58.23
GND  (via drill 0.6)
  other vias: 24.4,24.57 32.02,26.16 16.78,51.4 15.19,56.16 38.05,68.86 45.67,81.56 50.75,74.9 61.55,68.23 67.9,75.05 78.06,67.44 83.14,67.44 92.66,66.64 106.63,56.64 75.2,47.11 74.88,39.97 12.65,77.28 6.46,41.24 6.46,42.51 6.46,43.78 6.46,38.7 6.46,39.97 6.46,45.05 7.73,45.05 9,45.05 10.27,45.05 11.54,45.05 12.81,45.05 6.46,37.43 7.73,37.43 9,37.43 10.27,37.43 11.54,37.43 12.81,37.43 14.08,37.43 15.35,37.43 15.99,45.05 15.99,43.78 15.99,42.51 50.25,38.93 55.4,36.43 61.15,36.4 55.27,60.91
  pour Bottom: 0,100 119.92,100 119.92,0 0,0
  pour Top: 0,100 119.92,100 119.92,0 0,0
MISO  (via drill 0.6)
  Top 0.4: v82.98,54.26 82.5,54.26 79.81,51.57 arc-45 77.5,50.61 72.2,50.61 arc-45 67.3,52.64 62.59,57.35 arc45 ISP1.1
  Bottom 0.4: U1.16 61.17,61.63 arc-45 61.55,60.72 61.55,59.15 arc-45 61.23,58.39 ISP1.1 | U4.10 92.82,44.87 arc45 92.47,45.72 91.95,46.24 arc-45 91.39,47.59 91.39,50.08 arc90 86.9,54.58 83.3,54.58 v82.98,54.26
MOSI  (via drill 0.6)
  Top 0.4: v90.76,54.26 87.43,57.59 arc45 85.12,58.55 79.95,58.55 arc90 78.38,56.97 v78.38,53.46
  Bottom 0.4: ISP1.4 59.48,54.58 arc45 60.65,54.1 61.52,54.1 arc45 62.38,54.45 62.66,54.73 | 62.66,54.73 62.66,60.5 arc45 62.11,61.82 U1.15 | U4.11 94.09,44.84 arc45 93.72,45.74 92.73,46.73 arc-45 92.34,47.66 92.34,51.35 arc45 91.41,53.61 v90.76,54.26 | v78.38,53.46 78.06,53.78 70.59,53.78 arc-45 69.78,54.12 69.67,54.23 arc45 68.46,54.73 62.66,54.73
N$1
  Bottom 0.4: Q1.2 75.2,73.85 75.2,71.88 74.68,72.4 C1.1 70.48,72.4 70.12,72.04 arc45 69.31,71.7 67.14,69.53 arc-45 66.28,69.18 65.67,69.18 arc45 64.81,68.82 U1.7
N$2
  Bottom 0.4: U1.8 65.3,67.54 arc45 68.72,66.12 C2.1 72.94,66.12 arc-90 75.04,64.02 Q1.1
N$3
  Bottom 0.4: U6.4+IN 106.22,12.33 arc45 106.94,12.63 arc45 107.27,13.42 107.27,31.63 arc45 TR1.1 106.7,34.61 arc45 107.64,36.89 R60.1
N$4
  Bottom 0.4: U6.4-IN 106,13.6 | 106,13.6 106,13.59 | 106,13.6 106,14.86 U6.4OUT 103.78,14.87 arc-90 102.66,15.99 102.66,16.23 R1.1
N$5
  Bottom 0.4: R1.2 99.64,16.6 arc90 96.95,13.91 96.95,13.21 arc-45 96.44,11.97 94.42,9.95 arc45 93.93,8.78 93.93,6.32 arc-90 92.47,4.86 89.05,4.86 arc-90 87.42,6.48 GLIDE.P$1
N$6
  Bottom 0.4: U4.4 96.63,39.71 arc-90 97.53,40.61 102.8,40.61 arc45 105.82,41.86 107.37,43.41 arc45 108.65,46.49 FADER8.2
N$7
  Bottom 0.4: U4.2 99.17,37.91 arc45 99.28,37.64 arc90 103.03,37.64 108.19,42.8 arc45 109.97,47.09 109.97,48.76 arc90 104.15,54.58 99.93,54.58 arc90 93.65,48.3 FADER7.2
N$8  (via drill 0.6)
  Top 0.4: v86.95,44.42 82.51,44.42 arc-90 FADER6.2
  Bottom 0.4: U4.5 95.36,39.68 arc90 94.44,40.61 92.21,40.61 arc-45 89.73,41.63 v86.95,44.42
N$9
  Bottom 1.016: JP1.10 JP1.9 6.33,15.66 arc-90 2.49,19.5 D1.A
N$10
  Bottom 1.016: JP1.1 JP1.2 11.17,4.76 arc45 15.85,2.82 D2.C
N$11  (via drill 0.6)
  Top 0.4: v102.35,39.02 arc90 96.47,44.89 89.65,44.89 arc45 88.83,44.55 87.94,43.67 arc-45 86.69,43.15 v79.49,43.15
  Bottom 0.4: FADER5.2 63.65,48.83 arc-90 64.64,49.81 66.63,49.81 arc-90 67.42,49.02 67.42,46.98 arc90 69.98,44.42 77.13,44.42 arc-45 78.99,43.65 v79.49,43.15 | v102.35,39.02 100.52,39.02 U4.1
N$12  (via drill 0.6)
  Top 0.4: v69.17,37.59 89.63,37.59 arc45 92.1,38.61 v95.36,41.88
  Bottom 0.4: v95.36,41.88 U4.12 | v69.17,37.59 68.86,37.28 arc45 67.74,34.58 67.74,32.99 arc-90 64.69,29.94 56.67,29.94 arc-45 54.43,30.87 48.9,36.39 arc-45 47.26,40.36 47.26,44.03 arc-45 48.07,46 arc45 48.65,47.39 FADER4.2
N$13  (via drill 0.6)
  Top 0.4: v82.66,45.69 97.64,45.69 arc45 v99.17,46.32
  Bottom 0.4: FADER3.2 arc90 38.78,43.15 38.85,43.15 arc-45 42.59,41.6 54.28,29.91 arc45 56.12,29.15 64.58,29.15 arc-45 66.99,28.15 67.42,27.73 arc45 69.35,26.93 75.38,26.93 arc90 76.95,28.5 76.95,33.57 arc-45 77.21,34.2 77.48,34.47 arc45 77.9,35.48 77.9,37.58 arc-45 78.69,39.49 80.88,41.68 arc45 81.39,42.92 arc-45 82.45,45.47 v82.66,45.69 | v99.17,46.32 U4.15
N$14  (via drill 0.6)
  Top 0.4: v23.92,44.89 30.22,44.89 arc-45 33.57,43.5 v33.77,43.3 | v99.17,41.88 98.18,40.89 arc-45 97.51,40.61 arc45 96.55,40.21 93.07,36.73 arc-45 91.32,36 83.63,36 arc45 80.08,34.53 76.44,30.89 arc-45 74.98,30.29 70.06,30.29 arc45 68.09,29.47 v65.52,26.9
  Bottom 0.4: FADER2.2 arc90 22.04,44.89 v23.92,44.89 | v33.77,43.3 arc45 36.07,42.35 38.06,42.35 arc-45 42.61,40.47 53.97,29.11 arc45 55.78,28.36 61.61,28.36 arc-45 63.13,27.72 arc45 65.12,26.9 v65.52,26.9 | v99.17,41.88 arc-90 97.9,43.15 U4.14
N$15  (via drill 0.6)
  Top 0.4: v32.66,42.19 v23.77,42.19 | v96.95,41.88 92.95,37.88 arc-45 90.33,36.8 82.8,36.8 arc45 80.13,35.69 76.18,31.74 arc-45 74.58,31.08 67.74,31.08 arc45 64.31,29.66 v61.71,27.06
  Bottom 0.4: U4.13 96.63,42.64 arc45 v96.95,41.88 | v32.66,42.19 arc45 34.19,41.56 37.55,41.56 arc-45 41.62,39.87 53.41,28.08 arc45 55.88,27.06 v61.71,27.06 | v23.77,42.19 22.62,42.19 arc-45 19.96,43.3 17.92,45.34 arc45 14.4,46.8 4.63,46.8 arc-90 3.65,47.78 FADER1.2
N$16  (via drill 0.6)
  Top 0.4: GLIDE.P$3 99.39,6.52 arc45 105.11,8.89 v107.74,11.53
  Bottom 0.4: C3.1 89.96,8.52 GLIDE.P$2 GLIDE.P$3 | v107.74,11.53 108.11,11.9 arc-45 109.15,12.33 U6.1+IN
N$17
  Bottom 0.4: R6.1 R7.2 T1.B
N$18  (via drill 0.6)
  Top 0.4: v19.32,16.61 arc-45 20.11,14.69 20.11,11.43 arc90 29.07,2.48 105.04,2.48 arc-45 106.4,1.91 arc45 107.34,1.53 arc90 108.7,2.88 108.7,5.73 arc45 v107.74,8.04
  Bottom 0.4: R61.2 20.5,19.02 arc-45 19.62,16.91 v19.32,16.61 | v107.74,8.04 107.74,8.99 108.55,9.79 U6.2+IN
N$19
  Bottom 0.4: U6.1-IN 112.19,13.6 C6.1 114.83,13.23 R3.2 R2.1
N$20
  Bottom 0.4: U6.1OUT 112.19,14.87 C6.2 112.72,15.23 112.98,15.5 112.98,17.68 R4.1
N$21  (via drill 0.6)
  Top 0.4: v115.25,19.63 104.86,28.52 CV_OUT.TIP
  Bottom 0.4: v115.25,19.63 R4.2 R4.2 arc-90 117.11,16.18 117.11,15.62 R2.2
N$22
  Bottom 0.4: R10.2 72.66,35.05 T2.B 72.83,37.11 R9.1
N$23
  Bottom 0.4: R9.2 75.36,33.73 arc-45 RESET.TIP
N$24
  Bottom 0.4: U6.3-IN 102.67,8.52 C7.1 99.91,8.25 R11.2 | 97.52,6.19 R12.1 97.42,6.18 97.42,6.51 arc-90 99.12,8.2 R11.2 | R11.2
N$25
  Bottom 0.4: U6.3OUT 104.31,7.25 arc45 103.95,7.1 103.69,6.84 arc-45 103.13,6.61 102.75,6.61 C7.2 102.39,4.08 R13.2
N$26
  Bottom 0.4: R6.2 15.54,28.76 arc45 CLK_IN.TIP arc45 15.81,26.47 17.23,25.05 arc-45 17.73,23.83 arc90 19.12,22.45 R61.1
N$27
  Bottom 0.4: U6.2-IN 109.33,8.52 109.33,7.24 U6.2OUT 110.17,7.25 R14.2
N$28  (via drill 0.6)
  Top 0.4: CLOCK_OUT.TIP arc-90 48.85,24.63 48.85,16.52 arc90 61.3,4.07 96.39,4.07 arc45 97.34,4.46 97.43,4.55 arc-45 98.18,4.86 102.44,4.86 arc-45 v107.43,2.8
  Bottom 0.4: v107.43,2.8 110.16,2.8 R14.1
N$29  (via drill 0.6)
  Top 0.4: CLK_IN.NORM 17.61,20.02 arc-90 21,16.63 21,11.61 arc90 29.34,3.27 97.06,3.27 arc45 v98.22,3.75
  Bottom 0.4: R11.1 99.86,6.24 100.12,5.97 100.12,3.81 R13.1 100.17,3.75 v98.22,3.75
N$30  (via drill 0.6)
  Top 0.4: GLIDE1.P$2 29.96,8.52 arc-90 32.35,10.92 36.34,10.92 arc90 42.66,16.76 42.66,30.05 arc-17 43.77,37.69 arc15 v44.24,42.45
  Bottom 0.4: U1.22 48.37,56.9 arc47 v44.24,42.45
N$31
  Bottom 0.4: R15.1 11.22,48.33 FADER1.K
N$32
  Bottom 0.4: U2.1-IN 9.84,64.42 C10.1 7.62,64.47 R16.1 R17.2
N$33
  Bottom 0.4: U2.1OUT 11.44,63.15 arc45 11.07,63 arc-45 10.67,62.83 10.16,62.83 C10.2 R18.1
N$34
  Bottom 0.4: R16.2 7.57,60.45 R18.2 2.54,60.13 arc-90 0.75,61.93 0.75,92.02 arc-45 1.45,93.72 2.4,94.67 arc45 D3.2
N$35
  Bottom 0.4: R25.1 41.07,48.48 FADER3.K
N$36
  Bottom 0.4: R20.1 26.15,48.4 FADER2.K
N$37
  Bottom 0.4: U2.2-IN 9.91,69.5 C12.1 7.62,69.61 R21.1 R22.2 5.08,69.71
N$38
  Bottom 0.4: U2.2OUT 11.61,70.77 arc-45 10.95,71.04 arc45 10.46,71.24 10.16,71.24 C12.2 R23.1
N$39
  Bottom 0.4: R21.2 7.89,71.88 R23.2 7.89,78.04 arc-45 8.89,80.45 13.49,85.05 arc45 17.95,95.82 D4.2
N$40
  Bottom 0.4: U2.3-IN 19.84,69.5 C14.1 22.13,69.61 R26.1 R27.2 24.67,69.71
N$41
  Bottom 0.4: U2.3OUT 18.16,70.77 arc45 18.52,70.92 18.65,71.05 arc-45 19.12,71.24 19.59,71.24 C14.2 R28.1
N$42
  Bottom 0.4: R26.2 21.86,71.88 R28.2 23.17,74.1 arc90 28.21,79.14 28.21,86.34 arc-39 29.79,90.83 32.23,93.89 arc39 33,96.09 D5.2
N$43
  Bottom 0.4: FADER4.K 56.27,49.85 arc90 54.88,51.24 R30.1
N$44
  Bottom 0.4: U2.4-IN 19.91,64.42 C16.1 22.13,64.47 R31.1 R32.2
N$45
  Bottom 0.4: U2.4OUT 18.34,63.15 arc-45 18.66,63.02 arc45 19.11,62.83 19.59,62.83 C16.2 R33.1
N$46
  Bottom 0.4: R31.2 22.18,60.45 R33.2 27.32,60.13 arc90 29,61.82 29,81.06 arc-45 31.38,91.3 35.99,95.9 arc-45 37.14,96.38 46.44,96.38 arc-45 46.62,96.31 arc45 47.02,96.14 47.77,96.14 D6.2
N$47
  Bottom 0.4: R35.1 70.6,46.64 70.6,46.64 arc45 71.27,48.26 FADER5.K
N$48
  Bottom 0.4: U3.1-IN 100.23,64.26 C18.1 97.95,64.15 R36.1 R37.2
N$49
  Bottom 0.4: R38.1 C18.2 100.49,62.51 100.7,62.51 arc45 101.34,62.78 arc-45 101.85,62.99 U3.1OUT
N$50
  Bottom 0.4: R36.2 97.9,60.13 R38.2 93.01,59.81 arc-90 90.76,62.07 90.76,85.23 arc37 89.45,89.15 84.97,95.13 arc53 82.63,96.3 80.88,96.3 74.72,96.14 72.07,96.14 D7.2
N$51
  Bottom 0.4: R40.1 86.15,48.4 FADER6.K
N$52
  Bottom 0.4: U3.2-IN 100.39,69.34 C20.1 97.95,69.61 R41.1 R42.2
N$53
  Bottom 0.4: U3.2OUT 101.95,70.61 arc-45 101.54,70.78 101.27,71.05 arc45 100.81,71.24 100.49,71.24 C20.2 R43.1
N$54
  Bottom 0.4: R41.2 98.22,71.88 R43.2 98.06,74.1 98.06,78.62 arc45 97.33,80.39 88.12,93 arc-33 D8.2
N$55
  Bottom 0.4: R45.1 101.23,48.31 FADER7.K
N$56
  Bottom 0.4: U3.3-IN 110.01,69.34 C22.1 112.46,69.61 R46.1 R47.2
N$57
  Bottom 0.4: U3.3OUT 108.4,70.61 arc45 108.9,70.82 109.13,71.05 arc-45 109.61,71.24 109.92,71.24 C22.2 R48.1
N$58
  Bottom 0.4: R46.2 112.19,71.88 R48.2 112.51,74.26 112.51,79.49 arc45 111.94,80.86 102.67,93.37 arc-47 D9.2
N$59
  Bottom 0.4: R50.1 116,48.55 FADER8.K
N$60
  Bottom 0.4: U3.4-IN 110.24,64.26 C24.1 112.61,64.31 R51.1 R52.2
N$61
  Bottom 0.4: R53.1 C24.2 110.08,62.51 109.66,62.51 arc-45 109.1,62.75 109.09,62.75 arc45 108.52,62.99 U3.4OUT
N$62
  Bottom 0.4: R51.2 112.19,61.88 R53.2 117.93,59.97 arc90 119.17,61.21 119.17,86.02 arc45 117.87,89.16 arc-45 117,91.27 D10.2
N$63  (via drill 0.6)
  Top 0.4: U$7.1 58.36,11.92 arc45 58.85,13.1 58.85,16.38 arc45 58.35,17.58 arc-45 57.74,19.06 57.74,49.84 arc45 57.08,51.42 arc-45 56.63,52.52 56.63,57.43 arc-45 57.19,58.79 58.42,60.02 arc45 59.17,61.83 59.17,66.2 arc45 58.97,66.68 arc-90 58.97,68.67 v59.96,69.66
  Bottom 0.4: v59.96,69.66 61.55,71.25 U1.2 | R55.2 58.4,8.76 arc-90 57.42,9.75 U$7.1 U$7.2
N$64  (via drill 0.6)
  Top 0.4: v57.42,66.48 57.45,66.46 arc-45 58.37,64.22 58.37,62.44 arc-45 57.52,60.39 56.38,59.25 arc45 55.83,57.94 55.83,50.78 arc-45 55.6,50.22 55.42,50.04 arc45 55.04,49.11 55.04,46.09 arc-45 54.41,40.08 53.48,39.15 arc45 52.82,37.55 52.82,17.96 arc90 U$7.A
  Bottom 0.4: U1.9 64.53,66.19 arc45 63.82,66.48 v57.42,66.48
N$65
  Bottom 0.4: R56.2 U$7.K
N$66
  Bottom 0.4: R57.2 arc45 31.61,31.87 DIRSW.2
N$67  (via drill 0.6)
  Top 0.4: v71.71,52.51 71.71,55.28 arc45 71.31,56.25 70.88,56.67 arc-90 70.88,59.14 v71.07,59.34 | v49.48,43.12 arc-45 47.86,43.79 47.15,44.5 arc45 45.49,45.18 44.57,45.18 arc90 41.7,42.32 41.7,40.98 arc-90 38.28,37.56 v34.08,37.56
  Bottom 0.4: v71.71,52.51 71.24,52.05 arc-45 69.68,51.4 63.83,51.4 arc45 61.76,50.55 55.74,44.53 arc-45 52.34,43.12 v49.48,43.12 | v71.07,59.34 arc-45 69.67,59.92 U1.10 | DIRSW.1 25.19,33.59 arc-90 28.67,37.06 R58.2 32.87,37.06 arc45 v34.08,37.56
N$68  (via drill 0.6)
  Top 0.4: v71.71,57.59 72.38,56.92 arc-45 73.45,54.33 v73.45,52.35 | v50.75,41.69 arc-45 46.96,43.26 46.48,43.75 arc45 44.92,44.39 arc90 42.5,41.97 42.5,39.93 arc-45 v41.39,37.25
  Bottom 0.4: U1.11 70.27,58.19 arc45 v71.71,57.59 | v73.45,52.35 72.64,51.54 arc-45 70.39,50.61 64.34,50.61 arc45 62.06,49.66 55.95,43.55 arc-45 52.6,42.17 51.23,42.17 v50.75,41.69 | DIRSW.3 36.14,35 arc-45 R59.2 arc45 41.26,37.12 v41.39,37.25
N$69
  Bottom 0.4: U4.3 97.9,37.57 arc45 98.02,37.29 arc90 103.98,37.29 105.97,39.28 arc-45 107.19,39.78 107.44,39.78 R60.2
N$70
  Bottom 0.4: TR1.2 TR1.3 arc-45 100.61,32.65 100.01,32.05 arc-90 91.42,32.05 RANGE.2
N$71
  Bottom 0.4: D6.1 52.36,98.42 GATE4.TIP
N$72
  Bottom 0.4: D5.1 33.1,98.52 GATE3.TIP
N$73
  Bottom 0.4: D4.1 18.05,98.52 GATE2.TIP
N$74
  Bottom 0.4: D3.1 7.36,98.42 GATE1.TIP
N$75
  Bottom 0.4: D10.1 116.9,98.52 GATE8.TIP
N$76
  Bottom 0.4: D9.1 GATE7.TIP
N$77
  Bottom 0.4: D8.1 GATE6.TIP
N$78
  Bottom 0.4: D7.1 67.56,98.42 GATE5.TIP
RESET  (via drill 0.6)
  Top 0.4: v79.96,53.31 v79.96,57.43
  Bottom 0.4: T2.C 71.95,39.48 arc90 72.98,40.51 72.98,41.56 R8.1 79.25,41.88 arc90 80.6,43.22 80.6,45.85 arc45 80.26,46.66 arc-45 79.8,47.76 79.8,53.15 v79.96,53.31 | v79.96,57.43 79.96,71.66 arc90 74.98,76.64 64.75,76.64 arc45 63.89,76.29 61.02,73.41 arc90 U1.1
RST  (via drill 0.6)
  Top 0.4: ISP1.5 60.5,53.56 arc-45 59.96,54.87 v59.96,67.75
  Bottom 0.4: U1.29 59.3,68.03 arc45 v59.96,67.75
SCK  (via drill 0.6)
  Top 0.4: ISP1.3 arc-45 65.02,53.8 67.39,51.43 arc45 71.3,49.81 78,49.81 arc45 79.99,50.64 81.66,52.31 arc-45 83.69,53.15 84.09,53.15 v84.41,53.46
  Bottom 0.4: U1.17 59.04,61.65 arc-45 59.96,59.43 59.96,57.32 arc45 60.44,56.16 ISP1.3 | v84.41,53.46 84.72,53.78 86.72,53.78 arc-90 90.44,50.06 90.44,47.49 arc45 91.16,45.76 arc-45 91.55,44.81 U4.9

### Text on the board
tPlace: FADER1 | FADER2 | FADER3 | FADER4 | FADER7 | FADER8 | FADER5 | FADER6 | Pure Seq V2.2 | RATE | SLEW | PLAYPAUSESW | copyright GMSN Ltd 2016
bPlace: Pure Seq V2.2 | U5 | T2 | T1 | -12V